# EAGLE design GPS_radiologger_v22_L70_CMWX (EAGLE 9.6.2)
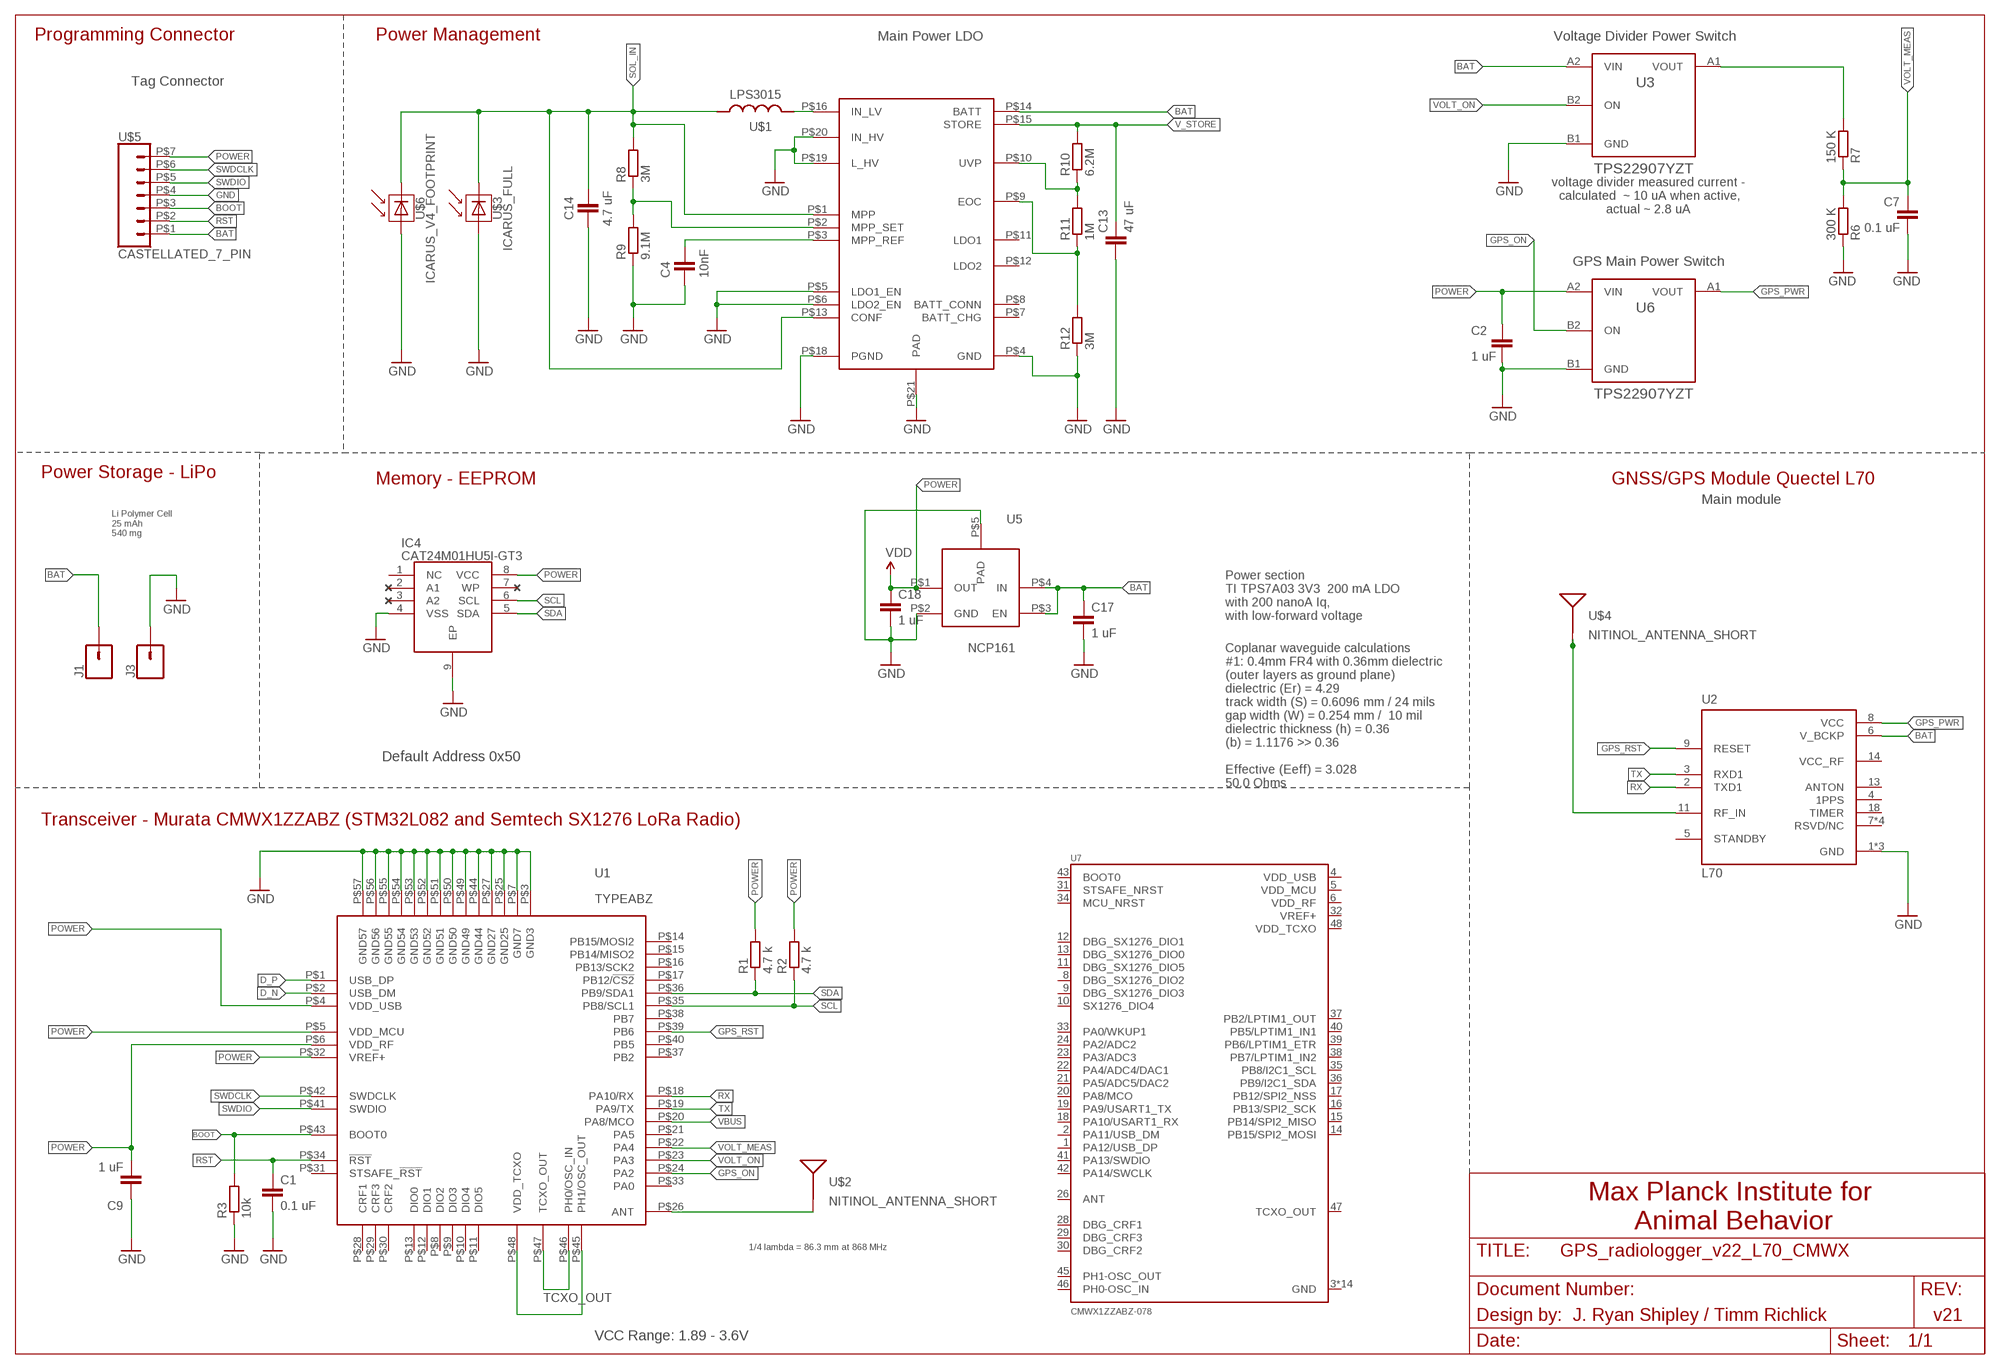
[diagram p0: schematic, sheet 1]

## Parts
C1  0.1 uF  C-EUC0201  [C0201]
C2  1 uF  C-EUC0201  [C0201]
C4  10nF  C-EUC0201  [C0201]
C7  0.1 uF  C-EUC0201  [C0201]
C9  1 uF  C-EUC0201  [C0201]
C13  47 uF  C-EUC0603  [C0603]
C14  4.7 uF  C-EUC0201  [C0201]
C17  1 uF  0402CAP.KW  [0402-CAP]
C18  1 uF  0402CAP.KW  [0402-CAP]
IC4  CAT24M01HU5I-GT3  [SON50P300X200X55-9N]
J1  CONN_01PTH_NO_SILK_SMALL  [1X01_SMALL]
J3  CONN_01PTH_NO_SILK_SMALL  [1X01_SMALL]
R1  4.7 k  R-EU_R0201  [R0201]
R2  4.7 k  R-EU_R0201  [R0201]
R3  10k  R-EU_R0201  [R0201]
R6  300 K  R-EU_R0201  [R0201]
R7  150 K  R-EU_R0201  [R0201]
R8  3M  R-EU_R0201  [R0201]
R9  9.1M  R-EU_R0201  [R0201]
R10  6.2M  R-EU_R0201  [R0201]
R11  1M  R-EU_R0201  [R0201]
R12  3M  R-EU_R0201  [R0201]
U1  TYPEABZ  [TYPEABZ]
U2  L70  [XCVR_L70]
U3  TPS22907YZT  [YFP0004-DSBGA]
U4  SPV1050  [SPV1050]
U5  NCP161  [NCP161]
U6  TPS22907YZT  [YFP0004-DSBGA]
U7  CMWX1ZZABZ-078  [XCVR_CMWX1ZZABZ-078]
U$1  LPS3015  [LPS3015]
U$2  NITINOL_ANTENNA_SHORT  [ICARUS_NITINOL_ANTENNA_SHORT]
U$3  ICARUS_FULL  [ICARUS_FULL]
U$4  NITINOL_ANTENNA_SHORT  [ICARUS_NITINOL_ANTENNA_SHORT]
U$5  CASTELLATED_7_PIN  [CASTELLATED_7_PIN]
U$6  ICARUS_V4_FOOTPRINT  [ICARUS_FULL_FOOTPRINT]

## Nets
BAT [battery]: C17.1 J1.P$1 U2.6(V_BCKP) U3.A2(VIN) U4.P$14(BATT) U5.P$3(EN) U5.P$4(IN) U$5.P$1
BOOT: R3.2 U1.P$43(BOOT0) U$5.P$3
D_N [diff_pair]: U1.P$2(USB_DM)
D_P [diff_pair]: U1.P$1(USB_DP)
GND: C1.2 C2.2 C4.2 C7.2 C9.1 C13.2 C14.2 C17.2 C18.2 IC4.4(VSS) IC4.9(EP) J3.P$1 R3.1 R6.1 R9.1 R12.1 U1.P$3(GND3) U1.P$7(GND7) U1.P$25(GND25) U1.P$27(GND27) U1.P$44(GND44) U1.P$49(GND49) U1.P$50(GND50) U1.P$51(GND51) U1.P$52(GND52) U1.P$53(GND53) U1.P$54(GND54) U1.P$55(GND55) U1.P$56(GND56) U1.P$57(GND57) U2.1(GND) U2.10(GND) U2.12(GND) U3.B1(GND) U4.P$4(GND) U4.P$5(LDO1_EN) U4.P$6(LDO2_EN) U4.P$18(PGND) U4.P$19(L_HV) U4.P$20(IN_HV) U4.P$21(PAD) U5.P$2(GND) U5.P$5(PAD) U6.B1(GND) U$3.P$2(MINUS) U$5.P$4 U$6.P$2(MINUS)
GPS_ON: U1.P$24(PA2) U6.B2(ON)
GPS_PWR: U2.8(VCC) U6.A1(VOUT)
GPS_RST: U1.P$39(PB6) U2.9(RESET)
N$1: U1.P$45(PH1/OSC_OUT) U1.P$48(VDD_TCXO)
N$2 [antenna]: U2.11(RF_IN) U$4.1(SIGNAL) U$4.2(SIGNAL) U$4.3(SIGNAL)
N$4: U4.P$16(IN_LV) U$1.2
N$6: R8.1 R9.2 U4.P$2(MPP_SET)
N$7: R7.2 U3.A1(VOUT)
N$8: R10.1 R11.2 U4.P$10(UVP)
N$9: R11.1 R12.2 U4.P$9(EOC)
N$11 [antenna]: U1.P$26(ANT) U$2.1(SIGNAL) U$2.2(SIGNAL) U$2.3(SIGNAL)
N$13: C4.1 U4.P$3(MPP_REF)
POWER [power]: C2.1 C9.2 C18.1 IC4.8(VCC) R1.2 R2.2 U1.P$4(VDD_USB) U1.P$5(VDD_MCU) U1.P$6(VDD_RF) U1.P$32(VREF+) U5.P$1(OUT) U6.A2(VIN) U$5.P$7 ; supply symbol labelled VDD
RST: C1.1 U1.P$34(!RST) U$5.P$2
RX: U1.P$18(PA10/RX) U2.2(TXD1)
SCL: IC4.6(SCL) R2.1 U1.P$35(PB8/SCL1)
SDA: IC4.5(SDA) R1.1 U1.P$36(PB9/SDA1)
SOL_IN [battery]: C14.1 R8.2 U4.P$1(MPP) U4.P$13(CONF) U$1.1 U$3.P$1(PLUS) U$6.P$1(PLUS)
SWDCLK: U1.P$42(SWDCLK) U$5.P$6
SWDIO: U1.P$41(SWDIO) U$5.P$5
TCXO_OUT: U1.P$46(PH0/OSC_IN) U1.P$47(TCXO_OUT)
TX: U1.P$19(PA9/TX) U2.3(RXD1)
V_STORE: C13.1 R10.2 U4.P$15(STORE)
VBUS: U1.P$20(PA8/MCO)
VOLT_MEAS: C7.1 R6.2 R7.1 U1.P$22(PA4)
VOLT_ON: U1.P$23(PA3) U3.B2(ON)
Unconnected: IC4.1(NC) IC4.2(A1) IC4.3(A2) IC4.7(WP) U1.P$8(DIO2) U1.P$9(DIO3) U1.P$10(DIO4) U1.P$11(DIO5) U1.P$12(DIO1) U1.P$13(DIO0) U1.P$14(PB15/MOSI2) U1.P$15(PB14/MISO2) U1.P$16(PB13/SCK2) U1.P$17(PB12/!CS2) U1.P$21(PA5) U1.P$28(CRF1) U1.P$29(CRF3) U1.P$30(CRF2) U1.P$31(STSAFE_!RST) U1.P$33(PA0) U1.P$37(PB2) U1.P$38(PB7) U1.P$40(PB5) U2.4(1PPS) U2.5(STANDBY) U2.7(RSVD/NC) U2.13(ANTON) U2.14(VCC_RF) U2.15(RSVD/NC) U2.16(RSVD/NC) U2.17(RSVD/NC) U2.18(TIMER) U4.P$7(BATT_CHG) U4.P$8(BATT_CONN) U4.P$11(LDO1) U4.P$12(LDO2) U7.1(PA12/USB_DP) U7.2(PA11/USB_DM) U7.8(DBG_SX1276_DIO2) U7.9(DBG_SX1276_DIO3) U7.10(SX1276_DIO4) U7.11(DBG_SX1276_DIO5) U7.12(DBG_SX1276_DIO1) U7.13(DBG_SX1276_DIO0) U7.14(PB15/SPI2_MOSI) U7.15(PB14/SPI2_MISO) U7.16(PB13/SPI2_SCK) U7.17(PB12/SPI2_NSS) U7.18(PA10/USART1_RX) U7.19(PA9/USART1_TX) U7.20(PA8/MCO) U7.21(PA5/ADC5/DAC2) U7.22(PA4/ADC4/DAC1) U7.23(PA3/ADC3) U7.24(PA2/ADC2) U7.26(ANT) U7.28(DBG_CRF1) U7.29(DBG_CRF3) U7.30(DBG_CRF2) U7.31(STSAFE_NRST) U7.33(PA0/WKUP1) U7.34(MCU_NRST) U7.35(PB8/I2C1_SCL) U7.36(PB9/I2C1_SDA) U7.37(PB2/LPTIM1_OUT) U7.38(PB7/LPTIM1_IN2) U7.39(PB6/LPTIM1_ETR) U7.40(PB5/LPTIM1_IN1) U7.41(PA13/SWDIO) U7.42(PA14/SWCLK) U7.43(BOOT0) U7.45(PH1-OSC_OUT) U7.46(PH0-OSC_IN) U7.47(TCXO_OUT)

## Notes on the sheet
- Programming Connector | Power Management | Main Power LDO | Voltage Divider Power Switch
- Tag Connector
- voltage divider measured current - 
  calculated  ~ 10 uA when active,
  actual ~ 2.8 uA
- GPS Main Power Switch
- Power Storage - LiPo
- Memory - EEPROM | GNSS/GPS Module Quectel L70
- Main module
- Li Polymer Cell
  25 mAh
  540 mg
- Power section
  TI TPS7A03 3V3  200 mA LDO
  with 200 nanoA Iq, 
  with low-forward voltage
- Default Address 0x50
- Coplanar waveguide calculations
  #1: 0.4mm FR4 with 0.36mm dielectric 
  (outer layers as ground plane)
  dielectric (Er) = 4.29
  track width (S) = 0.6096 mm / 24 mils
  gap width (W) = 0.254 mm /  10 mil
  dielectric thickness (h) = 0.36
  (b) = 1.1176 >> 0.36
  
  Effective (Eeff) = 3.028
  50.0 Ohms
- Transceiver - Murata CMWX1ZZABZ (STM32L082 and Semtech SX1276 LoRa Radio)
- Max Planck Institute for 
  Animal Behavior
- 1/4 lambda = 86.3 mm at 868 MHz
- Design by: | J. Ryan Shipley / Timm Richlick | v21
- VCC Range: 1.89 - 3.6V

## Power pins joined to a net without a drawn wire
GND: U7.3(GND) U7.7(GND) U7.25(GND) U7.27(GND) U7.44(GND) U7.49(GND) U7.50(GND) U7.51(GND) U7.52(GND) U7.53(GND) U7.54(GND) U7.55(GND) U7.56(GND) U7.57(GND)
VDD_MCU: U7.5(VDD_MCU)
VDD_RF: U7.6(VDD_RF)
VDD_TCXO: U7.48(VDD_TCXO)
VDD_USB: U7.4(VDD_USB)
VREF+: U7.32(VREF+)

## Library data of the parts
C1 C2 C4 C7 C9 C13 C14 = rcl:C-EU: CAPACITOR, European symbol; SPICEPREFIX: C
C17 C18 = SparkFun-Capacitors:0402CAP.KW
IC4 = CAT24M01HU5I-GT3-CorrectedV2:CAT24M01HU5I-GT3: EEPROM 1MB I2C SERIAL EEPROM Source: Datasheet <http://www.onsemi.com/pub/Collateral/CAT24M01-D.PDF>; ALLIED_NUMBER: 70300250; ALLIED_PRICE-STOCK: http://www.alliedelec.com/on-semiconductor-cat24m01hu5i-gt3/70300250/; DESCRIPTION: EEPROM 1MB I2C SERIAL EEPROM; HEIGHT: 0.55mm; MANUFACTURER_NAME: ON Semiconductor; MANUFACTURER_PART_NUMBER: CAT24M01HU5I-GT3; MOUSER_PART_NUMBER: 863-CAT24M01HU5I-GT3; MOUSER_PRICE-STOCK: https://www.mouser.com/Search/Refine.aspx?Keyword=863-CAT24M01HU5I-GT3; RS_PART_NUMBER: 7814831P; RS_PRICE-STOCK: http://uk.rs-online.com/web/p/products/7814831P
J1 J3 = SparkFun-Connectors:CONN_01: Single connection point. Often used as Generic Header-pin footprint for 0.1 inch spaced/style header connections On any of the 0.1 inch spaced packages, you can populate with these: Break Away Headers - Straight <https://www.sparkfun.com/products/116> (PRT-00116) Break Away Male Headers - Right Angle <https://www.sparkfun.com/products/553> (PRT-00553) Female Headers <https://www.sparkfun.com/products/115> (PRT-00115) Break Away Headers - Machine Pin <https://www.sparkfun.com/products/117> (PRT-00117) Break Away Female Headers - Swiss Machine Pin <https://www.sparkfun.com/products/743> (PRT-00743) This device is also useful as a general connection point to wire up your design to another part of your project. Our various solder wires solder well into these plated through hole pads. Hook-Up Wire - Assortment (Stranded, 22 AWG) <https://www.sparkfun.com/products/11375> (PRT-11375) Hook-Up Wire - Assortment (Solid Core, 22 AWG) <https://www.sparkfun.com/products/11367> (PRT-11367) View the entire wire category on our website here <https://www.sparkfun.com/categories/141> Special notes: SMTSO-256-ET is a "flush mount" nut for a 4-40 screw. We mostly use this on specialty testbeds; it is a nice way to connect hardware to your PCB at an adjustable hieght. Also note, the SNAP packages are for using a snappable style connector. We sell a baggie of snaps and they are also used on two LilyPad designs: Snap Assortment - 30 pack (male and female) <https://www.sparkfun.com/products/11347> (DEV-11347) LilyPad Arduino SimpleSnap <https://www.sparkfun.com/products/10941> (DEV-10941) LilyPad SimpleSnap Protoboard <https://www.sparkfun.com/products/10940> (DEV-10940)
R1-R3 R6-R12 = rcl:R-EU_: RESISTOR, European symbol; SPICEPREFIX: R
U1 = Kris:TYPEABZ: CMWX1ZZABZ-078
U2 = L70:L70: GPS Module Check prices <https://pricing.snapeda.com/parts/L70/Quectel/view-part?ref=eda>; AVAILABILITY: Warning; DESCRIPTION: L70, an SMD type module, brings the high performance of MTK positioning engine to the industrial applications with compact profile, ultra low power consumption and fast positioning capability.; MF: Quectel; MP: L70; PACKAGE: 2920 Quectel; PRICE: None
U3 U6 = TPS22916:TPS22907YZT
U4 = STM-SPV1050_V2:SPV1050
U5 = Kris:NCP161: NCP161 3V3 LDO voltage regulator
U7 = CMWX1ZZABZ-078:CMWX1ZZABZ-078: RF MODULE 860-930MHz 12.5x11.6x1.76mm 3.3Vdc Check availability <https://pricing.snapeda.com/parts/CMWX1ZZABZ-078/Murata/view-part?ref=eda>; AVAILABILITY: In Stock; DESCRIPTION: General ISM < 1GHz LoRa™ Transceiver Module 868MHz, 915MHz - Surface Mount; MF: Murata; MP: CMWX1ZZABZ-078; PACKAGE: Module Murata; PRICE: None; PURCHASE-URL: https://pricing.snapeda.com/search/part/CMWX1ZZABZ-078/?ref=eda
U$1 = coilcraft_custom:LPS3015
U$2 U$4 = Antenna_mounts:NITINOL_ANTENNA_SHORT
U$3 = TrisolX_Solar_Cells:ICARUS_FULL
U$5 = castellated_programmers:CASTELLATED_7_PIN
U$6 = TrisolX_Solar_Cells:ICARUS_V4_FOOTPRINT

## Net classes
1 power: width 0.152 mm
2 antenna: width 0.61 mm, clearance 0.254 mm
3 battery: width 0.152 mm
4 diff_pair: width 0.178 mm, clearance 0.152 mm

## Board
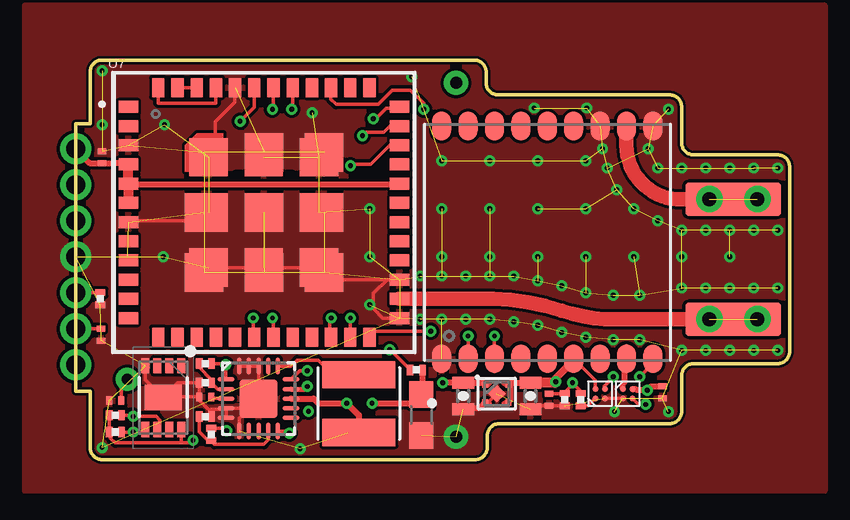
[diagram p1: board, top side]
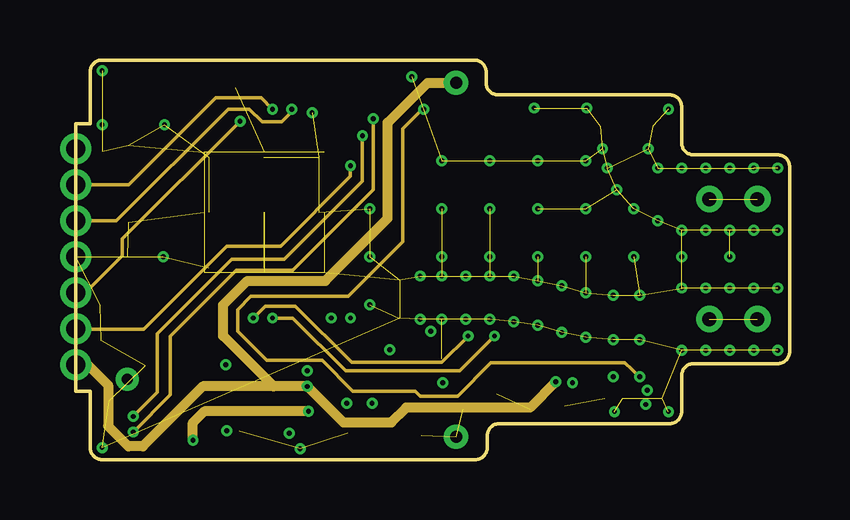
[diagram p2: board, inner layer Route2]
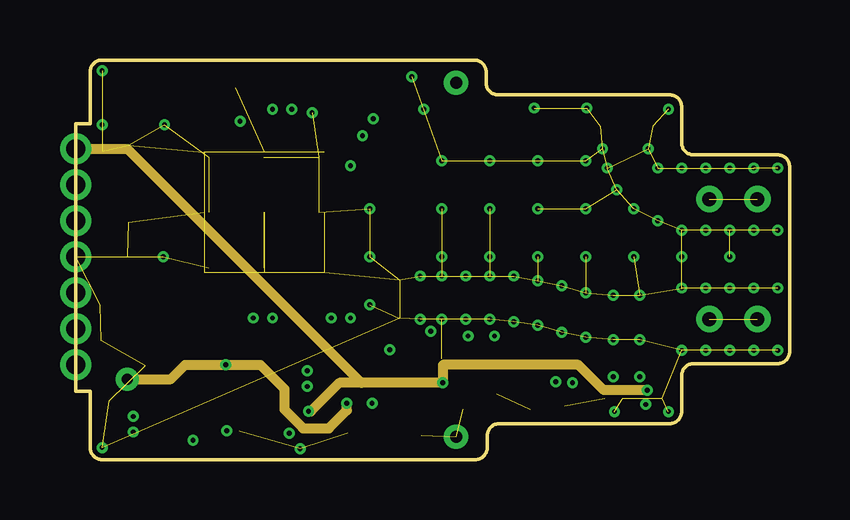
[diagram p3: board, inner layer Route15]
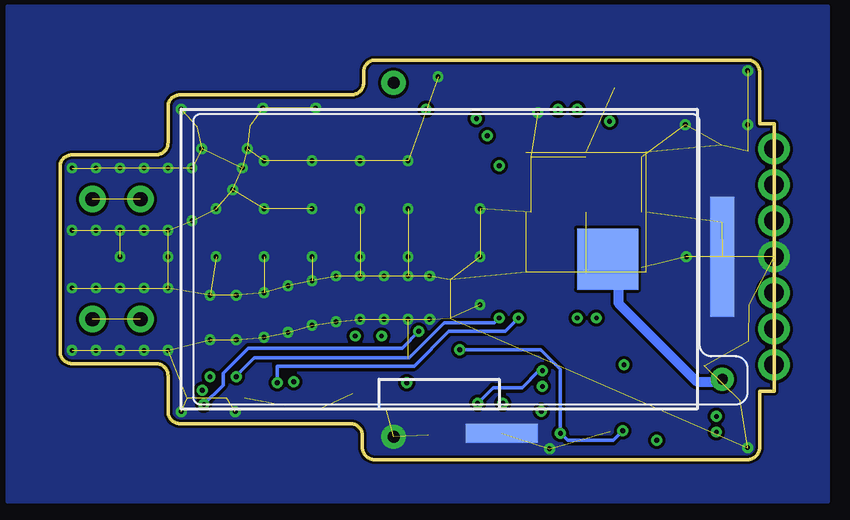
[diagram p4: board, bottom side, seen from below]

Size 29.75 x 16.65 mm. Coordinates in mm from the lower left corner, seen from the top.
Outline: 17.1,16.15 17.1,15.7 arc90 17.6,15.2 24.75,15.2 arc-90 25.25,14.7 25.25,13.2 arc90 25.75,12.7 29.25,12.7 arc-90 29.75,12.2 29.75,4.5 arc-90 29.25,4 25.75,4 arc90 25.25,3.5 25.25,2 arc-90 24.75,1.5 17.65,1.5 arc90 17.15,1 17.15,0.5 arc-90 16.65,0 1.1,0 arc-90 0.6,0.5 0.6,2.85 0,2.85 0,14 0.6,14 0.6,16.15 arc-90 1.1,16.65 16.6,16.65 arc-90 17.1,16.15
Copper layers (1*2+15*16): Top 0.035mm / dielectric 0.08mm / Route2 0.035mm / dielectric 0.08mm / Route15 0.035mm / dielectric 0.11mm / Bottom 0.035mm
Design rules "default *": minimum track width 5mil, minimum drill 0.2mm, track to track 5mil, track to pad 5mil, pad to pad 5mil, via to via 5mil, smd to smd 5mil, copper to edge 4mil, drill to drill 4mil, minimum pad ring 10mil, minimum via ring 5mil, stop-mask expansion 0mil, vias tented up to drill 20mil, thermal gap 0mil

### Footprints (pad centres in the part's own frame; a part is rotated, then mirrored left to right if it is on the bottom)
C0201 = smd 0.25 x 0.35: 1 -0.25,0; 2 0.25,0
C0603 = smd 1.1 x 1: 1 -0.85,0; 2 0.85,0
0402-CAP = smd 0.5 x 0.9: 1 -0.55,0; 2 0.55,0
SON50P300X200X55-9N = smd 0.63 x 0.32: 1 -1.33,0.75; 2 -1.33,0.25; 3 -1.33,-0.25; 4 -1.33,-0.75; 5 1.33,-0.75; 6 1.33,-0.25; 7 1.33,0.25; 8 1.33,0.75 | smd 1.06 x 1.56: 9 0,0
1X01_SMALL = drill 0.508: P$1 0,0
R0201 = smd 0.28 x 0.43: 1 -0.255,0; 2 0.255,0
TYPEABZ = smd 0.8 x 0.5: P$1 -5.65,4.4; P$2 -5.65,3.6; P$3 -5.65,2.8; P$4 -5.65,2; P$5 -5.65,1.2; P$6 -5.65,0.4; P$7 -5.65,-0.4; P$8 -5.65,-1.2; P$9 -5.65,-2; P$10 -5.65,-2.8; P$11 -5.65,-3.6; P$12 -5.65,-4.4; P$25 5.65,-4.4; P$26 5.65,-3.6; P$27 5.65,-2.8; P$28 5.65,-2; P$29 5.65,-1.2; P$30 5.65,-0.4; P$31 5.65,0.4; P$32 5.65,1.2; P$33 5.65,2; P$34 5.65,2.8; P$35 5.65,3.6; P$36 5.65,4.4 | smd 0.5 x 0.8: P$13 -4.4,-5.2; P$14 -3.6,-5.2; P$15 -2.8,-5.2; P$16 -2,-5.2; P$17 -1.2,-5.2; P$18 -0.4,-5.2; P$19 0.4,-5.2; P$20 1.2,-5.2; P$21 2,-5.2; P$22 2.8,-5.2; P$23 3.6,-5.2; P$24 4.4,-5.2; P$37 4.4,5.2; P$38 3.6,5.2; P$39 2.8,5.2; P$40 2,5.2; P$41 1.2,5.2; P$42 0.4,5.2; P$43 -0.4,5.2; P$44 -1.2,5.2; P$45 -2,5.2; P$46 -2.8,5.2; P$47 -3.6,5.2; P$48 -4.4,5.2 | smd 1.6 x 1.6: P$49 -2.3,2.3; P$50 0,2.3; P$51 2.3,2.3; P$52 -2.3,0; P$53 0,0; P$54 2.3,0; P$55 -2.3,-2.3; P$56 0,-2.3; P$57 2.3,-2.3
XCVR_L70 = smd 1.2 x 0.8: 1 -4.85,4.4; 2 -4.85,3.3; 3 -4.85,2.2; 4 -4.85,1.1; 5 -4.85,0; 6 -4.85,-1.1; 7 -4.85,-2.2; 8 -4.85,-3.3; 9 -4.85,-4.4; 10 4.85,-4.4; 11 4.85,-3.3; 12 4.85,-2.2; 13 4.85,-1.1; 14 4.85,0; 15 4.85,1.1; 16 4.85,2.2; 17 4.85,3.3; 18 4.85,4.4
YFP0004-DSBGA = smd 0.25 x 0.25: A1 0.2,-0.2; A2 -0.2,-0.2; B1 0.2,0.2; B2 -0.2,0.2
SPV1050 = smd 0.7 x 0.18: P$1 -1.35,0.8; P$2 -1.35,0.4; P$3 -1.35,0; P$4 -1.35,-0.4; P$5 -1.35,-0.8; P$11 1.35,-0.8; P$12 1.35,-0.4; P$13 1.35,0; P$14 1.35,0.4; P$15 1.35,0.8 | smd 0.18 x 0.7: P$6 -0.8,-1.35; P$7 -0.4,-1.35; P$8 0,-1.35; P$9 0.4,-1.35; P$10 0.8,-1.35; P$16 0.8,1.35; P$17 0.4,1.35; P$18 0,1.35; P$19 -0.4,1.35; P$20 -0.8,1.35 | smd 1.6 x 1.6: P$21 0,0
NCP161 = smd 0.24 x 0.24: P$1 -0.37,-0.48; P$2 0.37,-0.48; P$3 0.37,0.48; P$4 -0.37,0.48 | smd 0.52 x 0.52 rotated 45: P$5 0,0
XCVR_CMWX1ZZABZ-078 = smd 0.8 x 0.5: 1 -5.65,4.4; 2 -5.65,3.6; 3 -5.65,2.8; 4 -5.65,2; 5 -5.65,1.2; 6 -5.65,0.4; 7 -5.65,-0.4; 8 -5.65,-1.2; 9 -5.65,-2; 10 -5.65,-2.8; 11 -5.65,-3.6; 12 -5.65,-4.4; 25 5.65,-4.4; 26 5.65,-3.6; 27 5.65,-2.8; 28 5.65,-2; 29 5.65,-1.2; 30 5.65,-0.4; 31 5.65,0.4; 32 5.65,1.2; 33 5.65,2; 34 5.65,2.8; 35 5.65,3.6; 36 5.65,4.4 | smd 0.5 x 0.8: 13 -4.4,-5.2; 14 -3.6,-5.2; 15 -2.8,-5.2; 16 -2,-5.2; 17 -1.2,-5.2; 18 -0.4,-5.2; 19 0.4,-5.2; 20 1.2,-5.2; 21 2,-5.2; 22 2.8,-5.2; 23 3.6,-5.2; 24 4.4,-5.2; 37 4.4,5.2; 38 3.6,5.2; 39 2.8,5.2; 40 2,5.2; 41 1.2,5.2; 42 0.4,5.2; 43 -0.4,5.2; 44 -1.2,5.2; 45 -2,5.2; 46 -2.8,5.2; 47 -3.6,5.2; 48 -4.4,5.2 | smd 1 x 1: 49 -2.5,2.5 | smd 1.6 x 1.6: 50 0,2.5; 51 2.5,2.5; 52 -2.5,0; 53 0,0; 54 2.5,0; 55 -2.5,-2.5; 56 0,-2.5; 57 2.5,-2.5
LPS3015 = smd 1.14 x 3.05: 1 -1.2,0; 2 1.2,0
ICARUS_NITINOL_ANTENNA_SHORT = smd 4 x 1.4: 1 0,0 | drill 0.6: 2 -1,0; 3 1,0
ICARUS_FULL = smd 2.54 x 2.54: P$1 0,-7.02 | smd 0.8 x 3: P$2 -7.25,-2.61
CASTELLATED_7_PIN = drill 0.8: P$1 0,0; P$2 0,1.5; P$3 0,3; P$4 0,4.5; P$5 0,6; P$6 0,7.5; P$7 0,9
ICARUS_FULL_FOOTPRINT = drill 0.45: P$1 5,11.5 | smd 5 x 1: P$2 -0.1,11.5

### Placement (x,y rotation side)
C1  1.06,5.21 270 top
C2  24.45,2.8 270 top
C4  5.4,2.61 180 top
C7  19.73,2.5 270 top
C9  1.1,12.61 270 top
C13  14.4,1.86 270 top
C14  1.65,2.46 180 top
C17  18.95,2.65 270 top
C18  16.15,2.65 270 top
IC4  3.65,2.58 270 top
J1  15.85,15.7 0 top
J3  15.85,0.95 0 top
R1  1.65,1.15 180 top
R2  1.65,1.85 180 top
R3  1.02,6.71 90 top
R6  20.38,2.5 90 top
R7  21.05,2.5 270 top
R8  5.4,4 0 top
R9  5.4,3.2 0 top
R10  14.19,3.74 0 top
R11  5.65,1.05 90 top
R12  5.4,1.79 180 top
U1  7.84,10.3 0 top
U2  19.65,9.05 90 top
U3  21.85,2.75 270 top
U4  7.62,2.54 0 top
U5  17.55,2.75 270 top
U6  23,2.75 180 top
U7  7.85,10.3 0 top
U$1  11.8,2.33 90 top
U$2  27.4,5.85 0 top
U$3  13.95,8.35 90 bottom
U$4  27.4,10.85 180 top
U$5  0,3.95 0 top
U$6  13.65,8.35 270 bottom

### Tracks (layer width: path | path; a pad name or v marks a point on that pad's centre or on a via)
BAT  (via drill 0.2)
  Top 0.152: 9.54,2.94 v9.65,3.05 | U5.P$4 18.09,3.12 18.17,3.03 18.17,2.47 18.09,2.38 U5.P$3 | 20.65,4.05 20.75,4.05 20.9,4.05 21.65,3.3 U3.A2
  Top 0.203: U4.P$14 9.54,2.94
  Top 0.254: U5.P$4 18.11,3.2 C17.1
  Top 0.305: U2.6 20.75,4.05 | 20.65,4.05 20.65,4.03 20.01,3.39 v20.01,3.24
  Top 0.406: v20.01,3.24 19.97,3.2 C17.1
  Route2 0.406: v20.01,3.24 18.94,2.17 13.77,2.17 13.15,1.55 11.15,1.55 v9.65,3.05 8.25,3.05 | J1.P$1 14.66,15.7 13,14.04 13,10.05 10.4,7.45 7.15,7.45 6.14,6.44 6.14,5.16 8.25,3.05 | U$5.P$1 0.5,3.95 1.35,3.1 1.35,1.4 2.2,0.55 2.8,0.55 5.3,3.05 8.25,3.05
BOOT  (via drill 0.2)
  Top 0.152: U1.P$43 7.44,14.69 v6.85,14.1 | R3.2 1.02,6.95 U$5.P$3
  Route2 0.152: v6.85,14.1 1.95,9.2 1.95,8.5 0.4,6.95 U$5.P$3
GND  (via drill 0.2)  (116 unrouted)
  Top 0.15: U4.P$4 6.23,2.1 5.65,2.1 R12.1 5.65,1.97 5.15,2.47 | U1.P$25 12.8,5.9 12.4,6.3 12.4,6.93 12.97,7.5 U1.P$27
  Top 0.152: C4.2 R9.1 4.25,3.2 IC4.9 | U4.P$5 U4.P$4 7.25,2.15 | 7.25,2.15 7.62,2.52 U4.P$21 7.62,3.8 | 7.62,3.8 U4.P$18 | U1.P$55 U1.P$56 U1.P$57 10.14,7.81 10.45,7.5 U1.P$27 | U1.P$7 2.23,9.95 5.22,9.95 5.37,10.1 5.37,10.14 U1.P$52 | U4.P$20 U4.P$19 7.53,3.89 7.62,3.8 | U1.P$44 6.64,14.89 5.82,14.08 5.82,12.88 U1.P$49 | 5.15,2.47 C4.2 | C4.2 3.68,2.61 IC4.9 | U4.P$6 6.82,1.72 7.25,2.15 | U5.P$5 17.18,2.38 U5.P$2 | IC4.4 2.9,3.33 IC4.9 | R6.1 C7.2 19.1,2.25 C17.2 | U6.B1 U3.B1
  Top 0.254: U5.P$2 16.84,2.15 C18.2
  other vias: 23.25,8.45 15.25,12.45 17.25,12.45 19.25,12.45 21.25,12.45 21.25,10.45 19.25,10.45 17.25,10.45 15.25,10.45 15.25,8.45 17.25,8.45 19.25,8.45 21.25,8.45 25.25,8.45 27.25,8.45 12.25,8.45 12.25,10.45 12.25,6.45 15.25,7.65 17.25,7.65 19.25,7.45 21.25,6.95 23.5,6.85 19.25,5.6 17.25,5.85 15.25,5.85 21.25,5.1 25.25,7.15 27.25,7.15 27.25,4.55 25.25,4.55 27.25,9.55 25.25,9.55 22.4,6.85 20.25,7.25 18.25,7.65 16.25,7.65 18.25,5.75 20.25,5.3 16.25,5.85 14.35,7.65 14.35,5.85 26.25,7.15 26.25,4.55 28.25,4.55 28.25,7.15 28.25,9.55 26.25,9.55 26.25,12.15 27.25,12.15 28.25,12.15 29.25,9.55 29.25,7.15 29.25,12.15 29.25,4.55 23.25,10.45 22.15,12.15 22.55,11.25 24.25,9.95 25.25,12.15 24.25,12.15 23.85,12.95 21.95,12.95 9.85,14.45 3.7,13.95 1.1,16.2 14,15.95 19.1,14.65 21.3,14.65 24.7,14.6 24.7,2 3.65,8.45 9.35,0.45 22.4,5 23.5,5 1.1,13.95 1.1,0.5 22.45,2
  pour Top: -2.11,18.93 31.21,18.93 31.21,-1.3 -2.11,-1.3
  pour Bottom: -2.25,18.9 31.95,18.9 31.95,-1.75 -2.25,-1.75
GPS_ON  (via drill 0.2)
  Top 0.152: U1.P$24 12.49,5.35 v14.8,5.35 | v23.75,2.3 23.45,2.3 U6.B2
  Bottom 0.152: v14.8,5.35 15.5,4.65 21.9,4.65 22.95,3.6 22.95,3.1 v23.75,2.3
GPS_PWR
  Top 0.152: 23,4.15 U2.8
  Top 0.254: U6.A1 22.8,3.17 22.88,3.25 22.88,4.04 23,4.15
GPS_RST  (via drill 0.2)
  Top 0.152: v14.5,14.6 14.5,14.85 13.95,15.4 13.2,15.4 12.6,14.8 10.85,14.8 10.64,15.01 U1.P$39 | U2.9 24.05,4 v23.5,3.45
  Route2 0.152: v14.5,14.6 14.45,14.6 13.63,13.78 13.63,9.07 11.36,6.8 7.3,6.8 6.75,6.25 6.75,5.35 7.97,4.13 10.27,4.13 11.55,2.85 14.15,2.85 14.35,2.65 15.92,2.65 17.3,4.03 22.87,4.03 v23.5,3.45
N$1
  Top 0.152: U1.P$48 3.44,14.85 5.84,14.85 U1.P$45
N$2  (2 unrouted)
  Top 0.61: 22.95,13.75 U2.11 22.95,13.1 arc86 25.05,10.85 U$4.1
N$4
  Top 0.152: U$1.2 10.66,3.58 10.1,4.15 9.23,4.15 8.97,3.89 U4.P$16
N$6
  Top 0.152: U4.P$2 5.92,2.94 R9.2 5.65,3.33 5.14,3.84 R8.1
N$7
  Top 0.152: R7.2 21.34,2.24 U3.A1
N$8  (via drill 0.2)
  Top 0.152: R10.1 v13.1,4.58 v13.09,4.58 | R11.2 6.19,1.3 v6.3,1.2 | U4.P$10 8.81,1.19 v8.9,1.1
  Bottom 0.152: v6.3,1.2 6.7,0.8 8.6,0.8 v8.9,1.1 8.9,3.76 9.72,4.58 v13.09,4.58
N$9
  Top 0.152: U4.P$9 8.02,0.82 7.84,0.64 5.78,0.64 5.63,0.78 R11.1 5.52,0.8 5.14,1.17 R12.2
N$11  (2 unrouted)
  Top 0.61: U$2.1 22.05,5.85 arc-15 20.25,6.2 arc17 17.39,6.7 U1.P$26
N$13
  Top 0.152: U4.P$3 6.25,2.56 5.7,2.56 C4.1
POWER  (via drill 0.2)
  Top 0.152: IC4.8 4.4,0.7 | R2.2 R1.2 1.45,1.09 1.45,0.9 1.65,0.7 4.4,0.7 | v4.89,0.81 4.78,0.7 4.4,0.7
  Top 0.254: U5.P$1 16.99,3.2 C18.1 v15.3,3.2 | U1.P$32 13.44,11.45 2.24,11.45 U1.P$5 | U1.P$4 1.99,12.3 1.94,12.35 1.58,12.35 1.57,12.36 C9.2 0.59,12.36 U$5.P$7 | C2.1 24.35,3.05 24.34,3.04 23.97,3.04 v23.82,2.89 23.4,2.89 23.36,2.93 23.22,2.93 U6.A2
  Top 0.406: U1.P$4 U1.P$5 U1.P$6
  Route2 0.406: v9.7,2.01 5.36,2.01 4.89,1.54 v4.89,0.81
  Route15 0.406: 11.9,3.2 v15.3,3.2 15.3,3.95 20.95,3.95 22.01,2.89 v23.82,2.89 | v9.7,2.01 9.8,2.01 10.99,3.2 11.9,3.2 | 11.9,3.2 2.15,12.95 U$5.P$7
RST  (via drill 0.2)
  Top 0.152: U1.P$34 13.09,13.1 12.29,12.3 11.5,12.3 v11.45,12.25 | C1.1 1.04,5.45 U$5.P$2
  Route2 0.152: v11.45,12.25 11.45,11.8 8.55,8.9 6.3,8.9 2.84,5.44 U$5.P$2
RX  (via drill 0.2)
  Top 0.152: U1.P$18 7.4,5.14 v7.4,5.9 | U2.2 v16.35,5.15
  Route2 0.152: v7.4,5.9 7.9,6.4 9.15,6.4 11.5,4.05 15.25,4.05 v16.35,5.15
SCL  (via drill 0.2)
  Top 0.152: U1.P$35 13.09,13.9 12.84,13.65 12.1,13.65 v11.95,13.5 | R2.1 2.35,1.85 v2.4,1.8 3.35,1.8 3.5,1.65 3.5,1.35 IC4.6
  Route2 0.152: v11.95,13.5 11.95,11.6 8.7,8.35 6.5,8.35 3.4,5.25 3.4,2.8 v2.4,1.8
SDA  (via drill 0.2)
  Top 0.152: U1.P$36 13.44,14.65 12.95,14.65 12.5,14.2 v12.4,14.2 | IC4.5 2.79,1.15 v2.4,1.15 R1.1
  Route2 0.152: v12.4,14.2 12.4,11.25 9.05,7.9 6.7,7.9 3.95,5.15 3.95,2.7 v2.4,1.15
SOL_IN  (via drill 0.2)
  Top 0.152: U4.P$1 6.25,3.36 v6.25,3.95 6.2,4 R8.2 | U$6.P$1 2.15,3.25 1.9,3 C14.1
  Top 0.254: U$1.1 11.8,1.85 v11.3,2.35 10.1,2.35 9.91,2.54 U4.P$13
  Route15 0.406: U$6.P$1 3.96,3.35 4.56,3.95 v6.25,3.95 7.7,3.95 8.7,2.95 8.7,2.09 9.46,1.33 9.46,1.31 9.47,1.3 10.55,1.3 11.3,2.05 v11.3,2.35
  Bottom 0.406: U$6.P$1 2.25,3.25 3.21,3.25 6.48,6.52 6.48,7.9 U$3.P$1
SWDCLK  (via drill 0.2)
  Top 0.152: U1.P$42 8.24,14.79 8.2,14.75 v8.2,14.6
  Route2 0.152: v8.2,14.6 7.72,15.08 5.84,15.08 2.21,11.45 U$5.P$6
SWDIO  (via drill 0.2)
  Top 0.152: U1.P$41 9.04,14.64 v9,14.6
  Route2 0.152: v9,14.6 9,14.49 8.58,14.07 7.77,14.07 7.24,14.6 6.35,14.6 1.7,9.95 U$5.P$5
TCXO_OUT
  Top 0.152: U1.P$46 U1.P$47
TX  (via drill 0.2)
  Top 0.152: U2.3 v17.45,5.15 | v8.2,5.9 8.24,5.86 U1.P$19
  Route2 0.152: v8.2,5.9 9.05,5.9 11.25,3.7 16,3.7 v17.45,5.15
V_STORE  (via drill 0.2)
  Top 0.152: U4.P$15 9.33,3.7 v9.65,3.7
  Top 0.254: v12.35,2.35 14.04,2.35 C13.1 14.45,2.75 R10.2
  Bottom 0.152: v12.35,2.35 11.7,3 10.5,3 9.8,3.7 v9.65,3.7
VOLT_MEAS  (via drill 0.2)
  Top 0.152: U1.P$22 10.59,5.06 10.59,5.84 v10.65,5.9 | C7.1 R6.2 20.38,2.8 20.7,3.12 v20.7,3.2 21.05,2.85 R7.1
  Bottom 0.152: v10.65,5.9 11.2,5.35 13.55,5.35 15,3.9 20.7,3.9 v20.7,3.2
VOLT_ON  (via drill 0.2)
  Top 0.152: U1.P$23 11.44,5.89 v11.45,5.9 | v22.4,3.45 22.01,3.06 22.01,2.91 U3.B2
  Bottom 0.152: v11.45,5.9 11.65,5.7 13.74,5.7 15.19,4.25 21.65,4.25 22.4,3.5 v22.4,3.45